# EAGLE design vsauce (EAGLE 7.7.0)
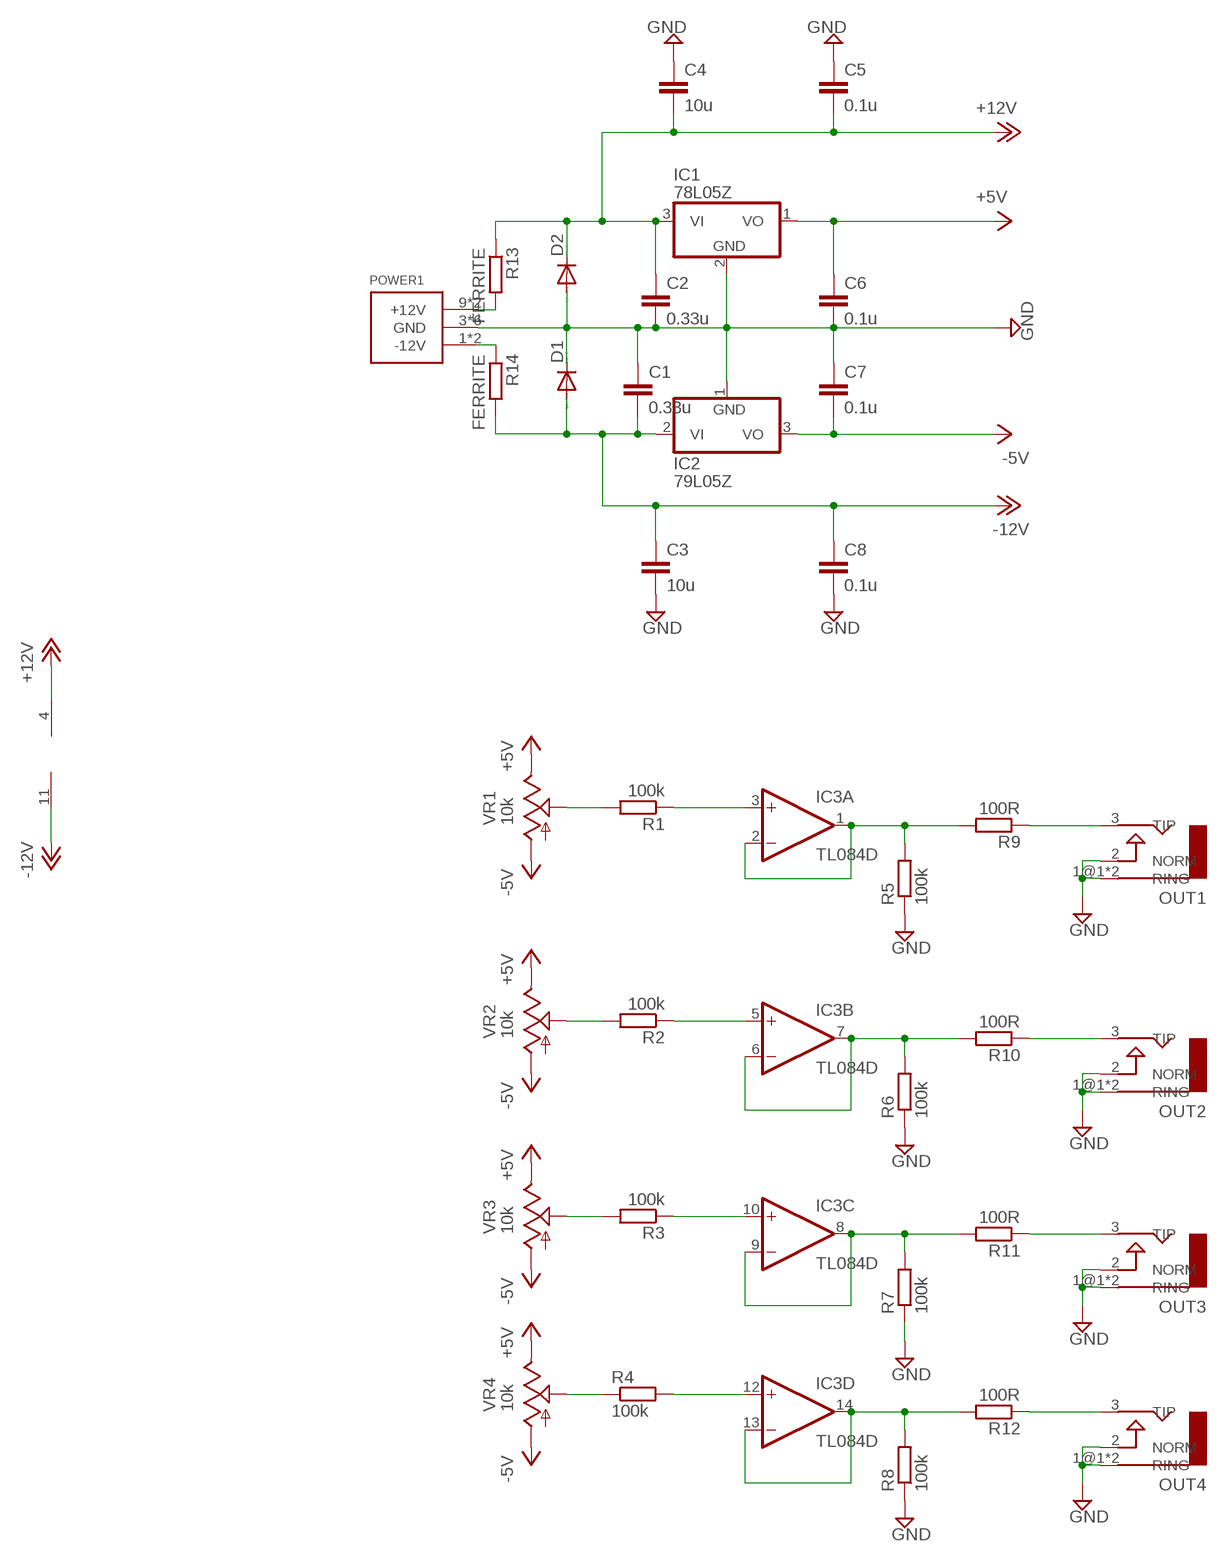
[diagram p0: schematic, sheet 1]

## Parts
C1  0.33u  C-EUC0805  [C0805]
C2  0.33u  C-EUC0805  [C0805]
C3  10u  C-EUC0805  [C0805]
C4  10u  C-EUC0805  [C0805]
C5  0.1u  C-EUC0805  [C0805]
C6  0.1u  C-EUC0805  [C0805]
C7  0.1u  C-EUC0805  [C0805]
C8  0.1u  C-EUC0805  [C0805]
D1  DIODE-SOD323-W  [SOD323-W]
D2  DIODE-SOD323-W  [SOD323-W]
IC1  78L05Z  [TO92]
IC2  79L05Z  7905L  [TO92]
IC3  TL084D  [SO14]
OUT1  V1  AUDIO-JACKERTHENVAR  [ERTHENVAR-JACK]
OUT2  V2  AUDIO-JACKERTHENVAR  [ERTHENVAR-JACK]
OUT3  V3  AUDIO-JACKERTHENVAR  [ERTHENVAR-JACK]
OUT4  V4  AUDIO-JACKERTHENVAR  [ERTHENVAR-JACK]
POWER1  POWER_SIMPLE10  [POWER_10]
R1  100k  R-EU_R0805  [R0805]
R2  100k  R-EU_R0805  [R0805]
R3  100k  R-EU_R0805  [R0805]
R4  100k  R-EU_R0805  [R0805]
R5  100k  R-EU_R0805  [R0805]
R6  100k  R-EU_R0805  [R0805]
R7  100k  R-EU_R0805  [R0805]
R8  100k  R-EU_R0805  [R0805]
R9  100R  R-EU_R0805  [R0805]
R10  100R  R-EU_R0805  [R0805]
R11  100R  R-EU_R0805  [R0805]
R12  100R  R-EU_R0805  [R0805]
R13  FERRITE  R-EU_R0805  [R0805]
R14  FERRITE  R-EU_R0805  [R0805]
VR1  10k  9MM_SNAP-IN_POT_  [9MM_SNAP-IN_POT]
VR2  10k  9MM_SNAP-IN_POT_  [9MM_SNAP-IN_POT]
VR3  10k  9MM_SNAP-IN_POT_  [9MM_SNAP-IN_POT]
VR4  10k  9MM_SNAP-IN_POT_  [9MM_SNAP-IN_POT]

## Nets
+5V: C6.1 IC1.1(VO) VR1.3(E) VR2.3(E) VR3.3(E) VR4.3(E)
+12V: C2.1 C4.2 C5.2 D2.C IC1.3(VI) IC3.4(P:V+) R13.1
-5V: C7.2 IC2.3(VO) VR1.1(A) VR2.1(A) VR3.1(A) VR4.1(A)
-12V: C1.2 C3.1 C8.1 D1.A IC2.2(VI) IC3.11(P:V-) R14.2
GND: C1.1 C2.2 C3.2 C4.1 C5.1 C6.2 C7.1 C8.2 D1.C D2.A IC1.2(GND) IC2.1(GND) OUT1.1@1(RING) OUT1.1@2(RING) OUT1.2(NORM) OUT2.1@1(RING) OUT2.1@2(RING) OUT2.2(NORM) OUT3.1@1(RING) OUT3.1@2(RING) OUT3.2(NORM) OUT4.1@1(RING) OUT4.1@2(RING) OUT4.2(NORM) POWER1.3(GND) POWER1.4(GND) POWER1.5(GND) POWER1.6(GND) POWER1.7(GND) POWER1.8(GND) R5.1 R6.1 R7.1 R8.1
N$1: IC3.1(A:OUT) IC3.2(A:-IN) R5.2 R9.2
N$2: IC3.6(B:-IN) IC3.7(B:OUT) R6.2 R10.2
N$3: IC3.8(C:OUT) IC3.9(C:-IN) R7.2 R11.2
N$4: IC3.13(D:-IN) IC3.14(D:OUT) R8.2 R12.2
N$5: IC3.3(A:+IN) R1.1
N$6: IC3.5(B:+IN) R2.1
N$7: IC3.10(C:+IN) R3.1
N$8: IC3.12(D:+IN) R4.2
N$9: R3.2 VR3.2(S)
N$10: R4.1 VR4.2(S)
N$11: R2.2 VR2.2(S)
N$12: R1.2 VR1.2(S)
N$13: OUT1.3(TIP) R9.1
N$14: OUT2.3(TIP) R10.1
N$15: OUT3.3(TIP) R11.1
N$16: OUT4.3(TIP) R12.1
N$17: POWER1.9(+12V) POWER1.10(+12V) R13.2
N$18: POWER1.1(-12V) POWER1.2(-12V) R14.1

## Library data of the parts
C1-C8 = rcl:C-EU: CAPACITOR, European symbol
D1 D2 = diode:DIODE-: DIODE
IC1 = linear:78*: Positive VOLTAGE REGULATOR Source: http://cache.national.com/ds/LM/LM78L05.pdf http://www.fairchildsemi.com/ds/LM/LM7805.pdf
IC2 = linear:79*: Negative VOLTAGE REGULATOR
IC3 = linear:TL084: OP AMP
OUT1-OUT4 = erthenvar:AUDIO-JACK: Switching Mono 3.5mm Audio Jack from Erthenvar.
POWER1 = eurorack:POWER_SIMPLE
R1-R14 = rcl:R-EU_: RESISTOR, European symbol
VR1-VR4 = MusicThingModular:9MM_SNAP-IN_POT: 9mm vertical snap-in pot, Alpha / Panasonic style

## Board
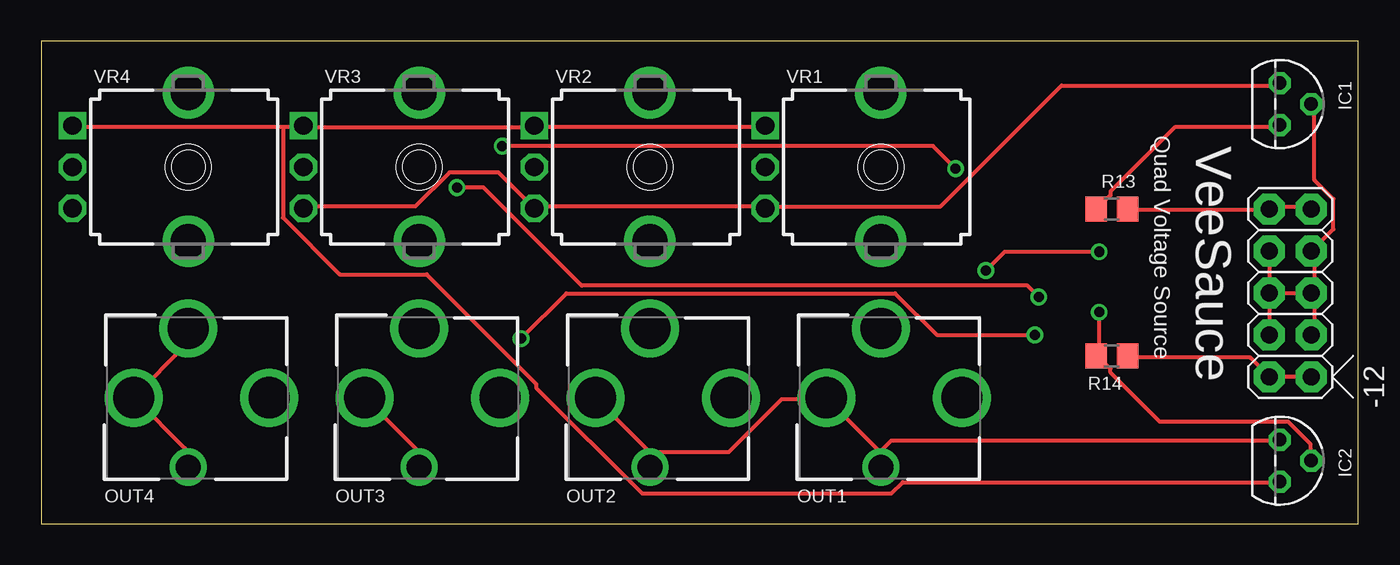
[diagram p1: board, top side]
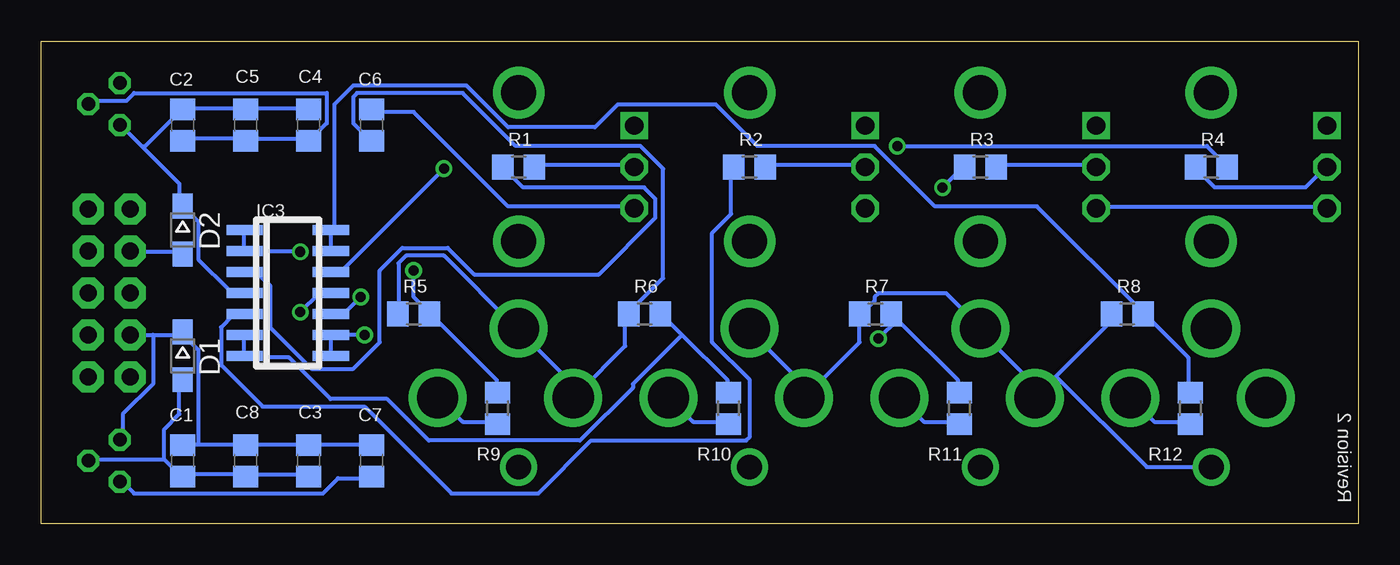
[diagram p2: board, bottom side, seen from below]

Size 79.68 x 29.2 mm. Coordinates in mm from the lower left corner, seen from the top.
Outline: 0,0 79.68,0 79.68,29.2 0,29.2 0,0
Copper layers (1*16): Top 0.035mm / dielectric 1.5mm / Bottom 0.035mm
Design rules "default": minimum track width 10mil, minimum drill 24mil, track to track 8mil, track to pad 8mil, pad to pad 8mil, via to via 8mil, smd to smd 8mil, copper to edge 40mil, drill to drill 8mil, minimum pad ring 10mil, minimum via ring 8mil, stop-mask expansion 4mil, vias tented up to drill 0mil, thermal gap 10mil

### Footprints (pad centres in the part's own frame; a part is rotated, then mirrored left to right if it is on the bottom)
C0805 = smd 1.3 x 1.5: 1 -0.95,0; 2 0.95,0
SOD323-W = smd 1.5 x 1.2: A 1.45,0; C -1.45,0
TO92 = drill 0.813 octagon: 1 -1.27,0; 2 0,1.905; 3 1.27,0
SO14 = smd 0.6 x 2.2: 1 -3.81,-2.6; 2 -2.54,-2.6; 3 -1.27,-2.6; 4 0,-2.6; 5 1.27,-2.6; 6 2.54,-2.6; 7 3.81,-2.6; 8 3.81,2.6; 9 2.54,2.6; 10 1.27,2.6; 11 0,2.6; 12 -1.27,2.6; 13 -2.54,2.6; 14 -3.81,2.6
ERTHENVAR-JACK = drill 2.5: 1@1 -4.2,0; 2 0,-3.3; 3 0,4.9 | drill 1.5: 1@2 4.2,0
POWER_10 = drill 1.016 pad 1.88 octagon: 1 -5.08,-1.27; 2 -5.08,1.27; 3 -2.54,-1.27; 4 -2.54,1.27; 5 0,-1.27; 6 0,1.27; 7 2.54,-1.27; 8 2.54,1.27; 9 5.08,-1.27; 10 5.08,1.27
R0805 = smd 1.3 x 1.5: 1 -0.95,0; 2 0.95,0
9MM_SNAP-IN_POT = drill 1.1 square: 1 -2.5,-7 | drill 1.1 octagon: 2 0,-7; 3 2.5,-7 | drill 2.1 pad 2.794: CHASSIS1 -4.5,0; CHASSIS2 4.5,0

### Placement (x,y rotation side)
C1  71.12,3.81 270 bottom
C2  71.12,24.13 270 bottom
C3  63.5,3.81 90 bottom
C4  63.5,24.13 90 bottom
C5  67.31,24.13 90 bottom
C6  59.69,24.13 270 bottom
C7  59.69,3.81 270 bottom
C8  67.31,3.81 90 bottom
D1  71.12,10.16 270 bottom
D2  71.12,17.78 270 bottom
IC1  74.93,25.4 270 top
IC2  74.93,3.81 270 top
IC3  64.77,13.97 270 bottom
OUT1  50.8,7.62 270 top
OUT2  36.83,7.62 270 top
OUT3  22.86,7.62 270 top
OUT4  8.89,7.62 270 top
POWER1  75.56,13.97 90 top
R1  50.8,21.59 0 bottom
R2  36.83,21.59 0 bottom
R3  22.86,21.59 0 bottom
R4  8.89,21.59 0 bottom
R5  57.15,12.7 0 bottom
R6  43.18,12.7 0 bottom
R7  29.21,12.7 0 bottom
R8  13.97,12.7 0 bottom
R9  52.07,6.99 90 bottom
R10  38.1,6.99 90 bottom
R11  24.13,6.99 90 bottom
R12  10.16,6.99 90 bottom
R13  64.77,19.05 0 top
R14  64.77,10.16 180 top
VR1  50.8,21.59 270 top
VR2  36.83,21.59 270 top
VR3  22.86,21.59 270 top
VR4  8.89,21.59 270 top

### Tracks (layer width: path | path; a pad name or v marks a point on that pad's centre or on a via)
+5V
  Top 0.254: IC1.1 74.75,26.52 61.72,26.52 54.41,19.2 43.89,19.2 VR1.3 43.66,19.2 29.95,19.2 VR2.3 29.72,19.2 27.66,21.26 24.69,21.26 22.63,19.2 16,19.2 VR3.3
  Bottom 0.254: VR4.3 2.06,19.2 15.77,19.2 VR3.3 | C6.1 59.66,24.92 57.15,24.92 51.44,19.2 43.89,19.2 VR1.3
+12V
  Top 0.254: R13.1 64.01,19.2 64.69,19.89 64.69,20.12 68.58,24 74.75,24 IC1.3
  Bottom 0.254: C4.2 63.55,25.15 67.21,25.15 C5.2 67.44,25.15 71.09,25.15 C2.1 71.32,24.92 73.38,22.86 73.61,22.86 | 73.61,22.86 74.75,24 IC1.3 | 73.61,22.86 71.32,20.57 71.32,19.43 D2.C 71.09,19.2 70.18,18.29 70.18,16 68.35,14.17 67.44,14.17 IC3.4
-5V
  Top 0.254: VR1.1 43.66,24 29.95,24 VR2.1 29.72,24 16,24 VR3.1 15.77,24 14.63,24 | 14.63,24 2.06,24 VR4.1 | 14.63,24 14.63,18.52 18.06,15.09 23.32,15.09 29.95,8.46 29.95,8.23 36.35,1.83 51.44,1.83 52.12,2.52 74.75,2.52 IC2.3
  Bottom 0.254: C7.2 59.89,2.74 61.72,2.74 62.64,1.83 74.07,1.83 74.75,2.52 IC2.3
-12V  (via drill 0.61)
  Top 0.254: IC2.2 76.81,3.89 76.81,4.8 75.44,6.17 67.67,6.17 64.69,9.14 64.69,9.37 64.01,10.06 R14.2 64.01,10.29 v64.01,12.8
  Bottom 0.254: C3.1 63.55,2.97 67.21,2.97 C8.1 67.44,2.97 71.09,2.97 C1.2 71.32,2.97 72.24,3.89 | 72.24,3.89 72.24,5.71 71.32,6.63 71.32,8.69 D1.A | v64.01,12.8 62.87,13.95 62.18,13.95 IC3.11 | 72.24,3.89 76.81,3.89 IC2.2
GND
  Top 0.254: POWER1.8 POWER1.6 74.3,13.95 | POWER1.3 77.04,11.43 77.04,13.95 POWER1.5 | IC1.2 77.04,25.38 77.04,20.8 78.18,19.66 78.18,17.83 77.04,16.69 POWER1.7 77.04,16.46 77.04,14.17 POWER1.5 | 74.3,13.95 76.81,13.95 POWER1.5 | 74.3,13.95 POWER1.4 | 50.75,4.34 50.75,3.43 OUT1.1@2 50.75,4.34 | 50.75,4.34 47.55,7.54 OUT1.2 47.32,7.54 44.81,7.54 41.6,4.34 36.8,4.34 | 36.8,4.34 36.8,3.43 OUT2.1@2 36.8,4.34 | 36.8,4.34 33.6,7.54 OUT2.2 | OUT4.1@2 8.69,3.43 8.69,4.57 5.71,7.54 OUT4.2 5.71,7.77 8.69,10.74 8.69,11.66 OUT4.1@1 | OUT3.1@2 22.86,4.34 19.66,7.54 OUT3.2 | 50.75,4.34 51.44,5.03 74.75,5.03 IC2.1
  Bottom 0.254: C7.1 59.89,4.8 63.32,4.8 C3.2 63.55,4.8 67.21,4.8 C8.2 67.44,4.8 70.18,4.8 | 70.18,4.8 71.09,4.8 C1.1 | POWER1.4 72.92,11.43 | 72.92,11.43 71.32,11.43 D1.C 71.09,11.43 70.18,10.52 70.18,4.8 | 72.92,11.43 72.92,8.46 74.75,6.63 74.75,5.26 IC2.1 | D2.A 71.32,16.46 74.3,16.46 POWER1.8 | C2.2 71.09,23.32 67.44,23.32 C5.1 67.21,23.32 63.55,23.32 C4.1 63.32,23.32 62.41,24.23 62.41,26.06 74.07,26.06 74.52,25.6 76.81,25.6 IC1.2 | R5.1 58.06,12.8 58.06,15.77 57.61,16.23 55.32,16.23 50.98,11.89 OUT1.1@1 50.75,11.66 47.09,8 | 47.09,8 47.32,7.77 OUT1.2 47.09,8 | 47.09,8 44.35,10.74 44.35,12.57 R6.1 44.12,12.8 42.06,14.86 42.06,21.49 43.43,22.86 50.98,22.86 54.18,26.06 60.58,26.06 60.81,25.83 60.81,24.23 59.89,23.32 C6.2 | 33.15,8 33.38,7.77 OUT2.2 33.15,8 | 33.15,8 30.18,10.97 30.18,12.57 R7.1 29.95,12.8 29.26,13.49 29.26,13.72 29.03,13.95 24.92,13.95 22.86,11.89 OUT3.1@1 22.86,11.66 19.2,8 | 33.15,8 36.8,11.66 OUT2.1@1 | 19.2,8 19.43,7.77 OUT3.2 19.2,8 | 19.2,8 18.29,8.91 | 18.29,8.91 15.09,12.12 15.09,12.57 R8.1 | 18.29,8.91 12.8,3.43 8.91,3.43 OUT4.1@2
N$1  (via drill 0.61)
  Top 0.254: v64.01,16.46 58.29,16.46 v57.15,15.32
  Bottom 0.254: IC3.1 67.44,17.6 67.44,16.69 IC3.2 67.21,16.46 v64.01,16.46 | R9.2 52.12,8 52.12,8.69 56.01,12.57 R5.2 56.24,12.8 57.15,13.72 v57.15,15.32
N$2
  Bottom 0.254: IC3.6 67.44,11.43 67.44,10.29 IC3.7 67.21,10.06 64.69,10.06 62.18,7.54 58.75,7.54 56.24,5.03 47.09,5.03 43.89,8.23 43.89,8.46 40.92,11.43 | 40.92,11.43 42.06,12.57 R6.2 | 40.92,11.43 38.18,8.69 38.18,8 R10.2
N$3  (via drill 0.61)
  Top 0.254: v60.12,11.43 54.18,11.43 51.66,13.95 31.77,13.95 v29.03,11.2
  Bottom 0.254: IC3.8 62.18,10.29 IC3.9 v60.12,11.43 | 27.89,12.34 28.12,12.57 R7.2 27.89,12.34 | 27.89,12.34 24.23,8.69 24.23,8 R11.2 | 27.89,12.34 v29.03,11.2
N$4
  Bottom 0.254: IC3.13 62.18,16.69 62.18,17.6 IC3.14 61.95,17.83 61.95,25.38 60.81,26.52 53.95,26.52 51.44,24 46.18,24 44.81,25.38 38.86,25.38 36.35,22.86 29.26,22.86 25.6,19.2 19.43,19.2 13.03,12.8 R8.2 12.8,12.57 10.29,10.06 10.29,8 R12.2
N$5
  Bottom 0.254: R1.1 51.66,21.49 50.52,20.34 43.2,20.34 42.52,19.66 42.52,18.52 45.95,15.09 53.49,15.09 55.09,16.69 57.84,16.69 59.21,15.32 59.21,10.97 60.81,9.37 63.32,9.37 65.84,11.89 65.84,14.4 66.52,15.09 67.21,15.09 IC3.3
N$6
  Bottom 0.254: R2.1 37.95,21.49 37.95,18.75 39.09,17.6 39.09,10.97 36.8,8.69 36.8,5.26 37.03,5.03 46.41,5.03 49.61,1.83 54.86,1.83 60.12,7.09 66.29,7.09 68.81,9.6 68.81,11.89 68.12,12.57 67.44,12.57 IC3.5
N$7  (via drill 0.61)
  Top 0.254: v25.15,20.34 26.75,20.34 32.69,14.4 59.66,14.4 v60.35,13.72
  Bottom 0.254: v25.15,20.34 24,21.49 R3.1 | v60.35,13.72 61.27,12.8 61.95,12.8 IC3.10
N$8  (via drill 0.61)
  Top 0.254: v27.89,22.86 53.95,22.86 v55.32,21.49
  Bottom 0.254: v27.89,22.86 9.14,22.86 8,21.72 R4.2 | v55.32,21.49 61.49,15.32 61.95,15.32 IC3.12
N$9
  Bottom 0.254: R3.2 21.72,21.72 16,21.72 VR3.2
N$10
  Bottom 0.254: R4.1 9.83,21.49 8.69,20.34 3.2,20.34 2.06,21.49 VR4.2
N$11
  Bottom 0.254: R2.2 35.66,21.72 29.95,21.72 VR2.2
N$12
  Bottom 0.254: R1.2 49.84,21.72 43.89,21.72 VR1.2
N$13
  Bottom 0.254: R9.1 52.12,6.17 54.18,6.17 55.55,7.54 OUT1.3
N$14
  Bottom 0.254: R10.1 38.18,6.17 40.23,6.17 41.6,7.54 OUT2.3
N$15
  Bottom 0.254: R11.1 24.23,6.17 26.29,6.17 27.66,7.54 OUT3.3
N$16
  Bottom 0.254: R12.1 10.29,6.17 12.34,6.17 13.72,7.54 OUT4.3
N$17
  Top 0.254: R13.2 65.84,18.97 74.3,18.97 POWER1.10 74.3,19.2 76.81,19.2 POWER1.9
N$18
  Top 0.254: 74.3,8.91 73.15,10.06 65.84,10.06 R14.1 | 74.3,8.91 76.81,8.91 POWER1.1 | 74.3,8.91 POWER1.2

### Text on the board
tNames: Quad Voltage Source | VeeSauce
bNames: Revision 2